# Altium schematic sheet SoC.SchDoc
size A4; SheetNumber: 4; SheetTotal: 4
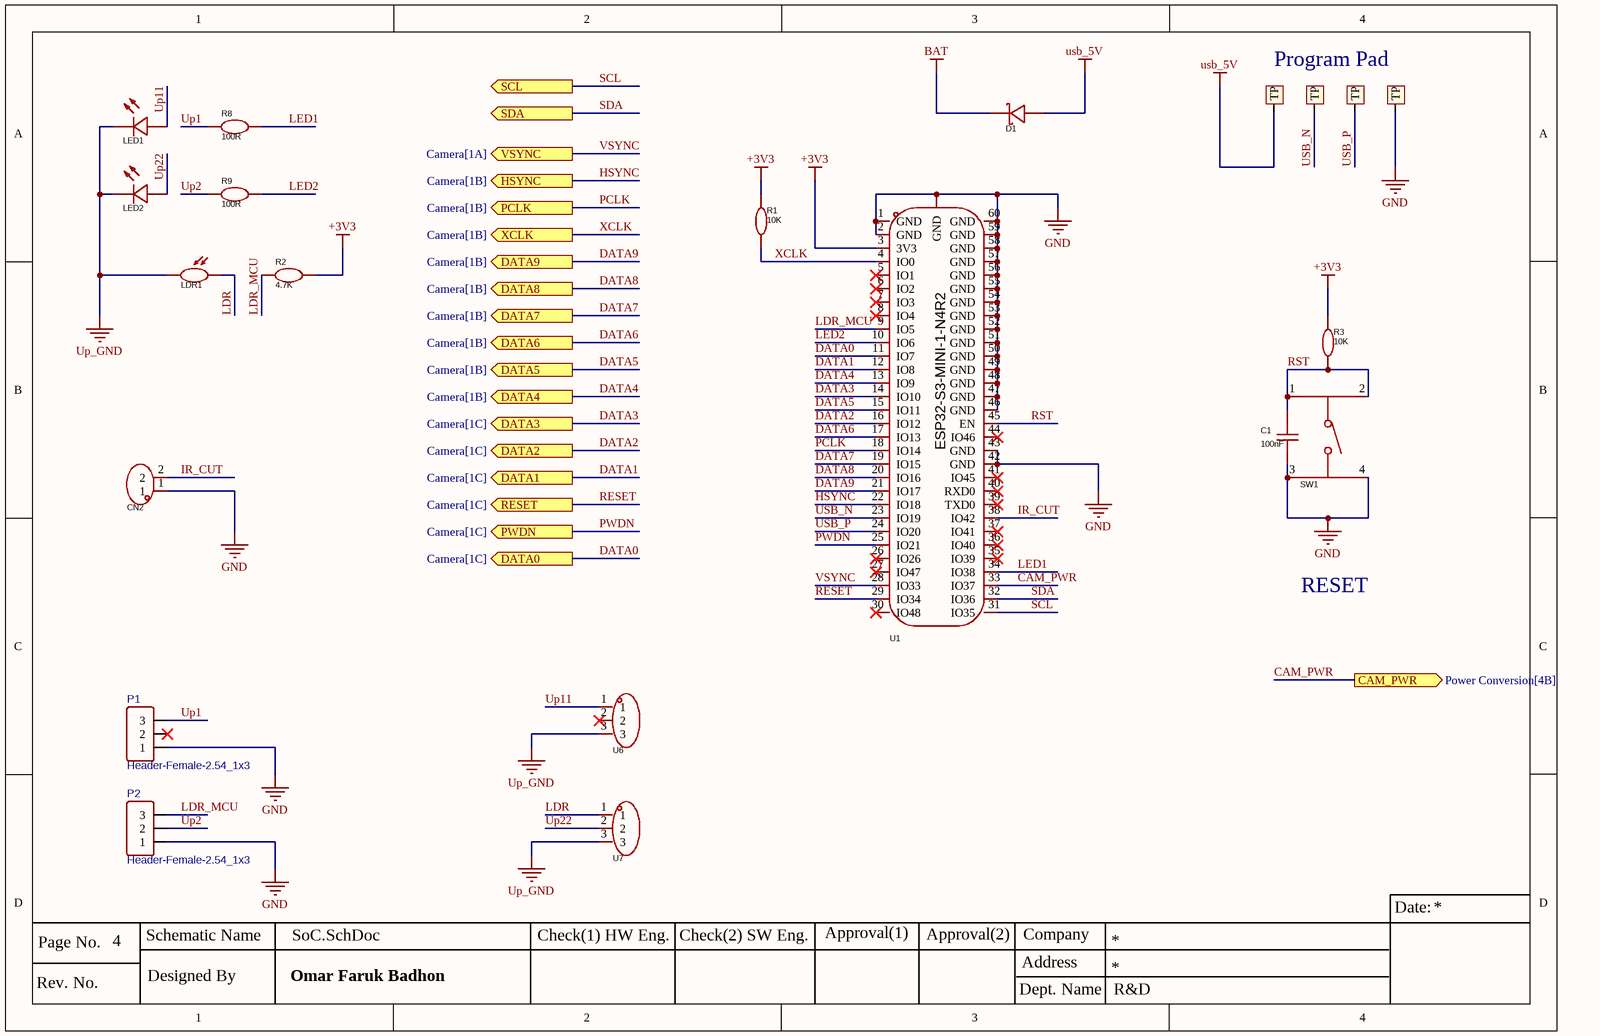
[diagram p0: SoC.SchDoc]

## Parts
C1  100nF  [100nF SMD Ceramic 201]
CN2  HDGC1501WV-2P  [2P white Connector 1.5mm]  (value not drawn)
D1  MBR120VLSFT1G  [Schottky Diode]  (value not drawn)
LDR1  GT36528  [LDR]  (value not drawn)
LED1  XYC-IRC18C-24  [LED SMD]  (value not drawn)
LED2  XYC-IRC18C-24  [LED SMD]  (value not drawn)
P1  Header-Female-2.54_1x3  [3P FH 2.54mm]
P2  Header-Female-2.54_1x3  [3P FH 2.54mm]
R1  10K  [10K SMD Ceramic 201]
R2  4.7K  [4k7 SMD 201]
R3  10K  [10K SMD Ceramic 201]
R8  100R  [100R 402]
R9  100R  [100R 402]
SW1  TS-1102-5516  [Push Button 4P]  (value not drawn)
TP1  TEST POINT  [TESTPOINT]  (value not drawn)
TP2  TEST POINT  [TESTPOINT]  (value not drawn)
TP3  TEST POINT  [TESTPOINT]  (value not drawn)
TP4  TEST POINT  [TESTPOINT]  (value not drawn)
U1  ESP32-S3-MINI-1-N4R2  [ESP32-S3-MINI-1-N8]
U6  HB-PH3-25413PB2GOP  [3P MH 2.54mm]  (value not drawn)
U7  HB-PH3-25413PB2GOP  [3P MH 2.54mm]  (value not drawn)

## Ports
CAM_PWR (out, see Power Conversion[4B]), DATA0 (out, see Camera[1C]), DATA1 (out, see Camera[1C]), DATA2 (out, see Camera[1C]), DATA3 (out, see Camera[1C]), DATA4 (out, see Camera[1B]), DATA5 (out, see Camera[1B]), DATA6 (out, see Camera[1B]), DATA7 (out, see Camera[1B]), DATA8 (out, see Camera[1B]), DATA9 (out, see Camera[1B]), HSYNC (out, see Camera[1B]), PCLK (out, see Camera[1B]), PWDN (out, see Camera[1C]), RESET (out, see Camera[1C]), SCL (out, see Camera[1A]), SDA (out, see Camera[1A]), VSYNC (out, see Camera[1A]), XCLK (out, see Camera[1B])

## Nets
+3V3: R1.2 R2.1 R3.2 U1.3(3V3)
BAT: D1.1(K)
GND: C1.1 CN2.1 P1.1 P2.1 SW1.3 SW1.4 TP4.1(TP) U1.1(GND) U1.2(GND) U1.42(GND) U1.43(GND) U1.46(GND) U1.47(GND) U1.48(GND) U1.49(GND) U1.50(GND) U1.51(GND) U1.52(GND) U1.53(GND) U1.54(GND) U1.55(GND) U1.56(GND) U1.57(GND) U1.58(GND) U1.59(GND) U1.60(GND) U1.GND
Up_GND: LDR1.1 LED1.1(C) LED2.1(C) U6.3 U7.3
usb_5V: D1.2(A) TP1.1(TP)
CAM_PWR: U1.33(IO37) ; port CAM_PWR
DATA0: U1.11(IO7) ; port DATA0
DATA1: U1.12(IO8) ; port DATA1
DATA2: U1.16(IO12) ; port DATA2
DATA3: U1.14(IO10) ; port DATA3
DATA4: U1.13(IO9) ; port DATA4
DATA5: U1.15(IO11) ; port DATA5
DATA6: U1.17(IO13) ; port DATA6
DATA7: U1.19(IO15) ; port DATA7
DATA8: U1.20(IO16) ; port DATA8
DATA9: U1.21(IO17) ; port DATA9
HSYNC: U1.22(IO18) ; port HSYNC
IR_CUT: CN2.2 U1.38(IO42)
LDR: LDR1.2 U7.1
LDR_MCU: P2.3 R2.2 U1.9(IO5)
LED1: R8.2 U1.34(IO38)
LED2: R9.2 U1.10(IO6)
PCLK: U1.18(IO14) ; port PCLK
PWDN: U1.25(IO21) ; port PWDN
RESET: U1.29(IO34) ; port RESET
RST: C1.2 R3.1 SW1.1 SW1.2 U1.45(EN)
SCL: U1.31(IO35) ; port SCL
SDA: U1.32(IO36) ; port SDA
Up1: P1.3 R8.1
Up2: P2.2 R9.1
Up11: LED1.2(A) U6.1
Up22: LED2.2(A) U7.2
USB_N: TP2.1(TP) U1.23(IO19)
USB_P: TP3.1(TP) U1.24(IO20)
VSYNC: U1.28(IO33) ; port VSYNC
XCLK: R1.1 U1.4(IO0) ; port XCLK

Not connected (* = marked no-connect by the designer): P1 2*; U1 5(IO1)* 6(IO2)* 7(IO3)* 8(IO4)* 26(IO26)* 27(IO47)* 30(IO48)* 35(IO39)* 36(IO40)* 37(IO41)* 39(TXD0)* 40(RXD0)* 41(IO45)* 44(IO46)*; U6 2*

## Notes on the sheet
- Program Pad
- RESET
- Date:
- Rev. No.
- Page No.
- Schematic Name
- Designed By
- Omar Faruk Badhon
- Check(1) HW Eng.
- Check(2) SW Eng.
- Approval(1)
- Approval(2)
- Address
- Company
- Dept. Name
- R&D

## Library data of the parts
C1 = 100nF SMD Ceramic 201: 10V 100nF X5R ±10% 0201 Multilayer Ceramic Capacitors MLCC - SMD/SMT ROHS; Manufacturer: muRata(村田); Symbol: GRM033R61A104KE84D; Add into BOM: yes; Device: GRM033R61A104KE84D; LCSC Part Name: 100nF ±10% 10V; Supplier Part: C161466; Manufacturer Part: GRM033R61A104KE84D; Supplier Footprint: 0201; JLCPCB Part Class: Extended Part; Datasheet: https://atta.szlcsc.com/upload/public/pdf/source/20181011/C161466_67687620A192BB2B75972275444AF1E7.pdf; Supplier: LCSC; Convert to PCB: yes; Value: 100nF; Tolerance: ±10%
CN2 = 2P Connector 1.5mm: Manufacturer: HDGC(华德共创); Add into BOM: yes; Pins Structure: 1x2P; Pitch: 1.5mm; Reference Series: ZH; Number of PINs Per Row: 2; Current Rating (Max): 1A; Symbol: HDGC1501WV-2P; Device: HDGC1501WV-2P; LCSC Part Name: 1x2P 间距:1.5mm 直插 系列:ZH; Supplier Part: C5175212; Manufacturer Part: HDGC1501WV-2P; Supplier Footprint: 插件,P=1.5mm; JLCPCB Part Class: Extended Part; Datasheet: https://atta.szlcsc.com/upload/public/pdf/source/20220916/0E4647A3A85E9D7CFB69507DE86E8F95.pdf; Supplier: LCSC; Convert to PCB: yes; Mounting Style: Direct Insert; Number of Pins: 2P; Number of Rows: 1
D1 = Schottky Diode: 20V 300mV@1A 1A SOD-123FL Schottky Diodes ROHS; Manufacturer: onsemi(安森美); Add into BOM: yes; Reverse Leakage Current (Ir): 600uA@20V; Symbol: MBR120VLSFT1G; Device: MBR120VLSFT1G; LCSC Part Name: 电压:20V 电流:1A; Supplier Part: C223608; Manufacturer Part: MBR120VLSFT1G; Supplier Footprint: SOD-123FL; JLCPCB Part Class: Extended Part; Datasheet: https://atta.szlcsc.com/upload/public/pdf/source/20221020/29D26ECD33A75D76A8E47ED9553F3BCF.pdf; Supplier: LCSC; Convert to PCB: yes; Forward Voltage (Vf@If): 300mV@1A; Reverse Voltage (Vr): 20V; Average Rectified Current (Io): 1A
LDR1 = LDR: SMD,2.4x3.6mm Photoresistors ROHS; Manufacturer: JCHL(晶创和立); Add into BOM: yes; Symbol: GT36528; Device: GT36528; LCSC Part Name: GT36528; Supplier Part: C2904881; Manufacturer Part: GT36528; Supplier Footprint: SMD,2.4x3.6mm; JLCPCB Part Class: Extended Part; Datasheet: https://atta.szlcsc.com/upload/public/pdf/source/20211014/6AB64DE2EFA295B23F73ED070F69DE44.pdf; Supplier: LCSC; Convert to PCB: yes
LED1 LED2 = LED SMD: Manufacturer: NEWOPTO(鑫永诚光电); Add into BOM: yes; Vf - Forward Voltage: 1.4V~1.8V; Power Dissipation: 900mW; Wavelength: 940nm; Current - DC Forward (If): 500mA; Reverse Voltage: 5V; View Angle: 120°; Symbol: XYC-IRC18C-24; Device: XYC-IRC18C-24; LCSC Part Name: XYC-IRC18C-24; Supplier Part: C2988733; Manufacturer Part: XYC-IRC18C-24; Supplier Footprint: SMD3030; JLCPCB Part Class: Extended Part; Datasheet: https://atta.szlcsc.com/upload/public/pdf/source/20220415/AF6ACF3234B7CCBAD1FA94129DBDDB73.pdf; Supplier: LCSC; Convert to PCB: yes; Operating Temperature: -40℃~+85℃
P1 P2 = Header-Female-2.54_1x3: Manufacturer: BOOMELE(博穆精密); Manufacturer Part: 2.54-1*3P母; Supplier Part: C146243; Supplier: LCSC; JLCPCB Part Class: Extended Part; spicePre: P; spiceSymbolName: Header-Female-2.54_1x3
R1 R3 = 10K SMD Ceramic 201: 50mW Thick Film Resistors 25V ±1% ±200ppm/℃ 10kΩ 0201 Chip Resistor - Surface Mount ROHS; Manufacturer: YAGEO(国巨); Symbol: AF0201FR-0710KL; Add into BOM: yes; Device: AF0201FR-0710KL; LCSC Part Name: 厚膜电阻 10kΩ ±1% 50mW; Supplier Part: C143978; Manufacturer Part: AF0201FR-0710KL; Supplier Footprint: 0201; JLCPCB Part Class: Extended Part; Datasheet: https://atta.szlcsc.com/upload/public/pdf/source/20180927/C229861_4ABDC471507C1ED6AFB4BA66AFC8620A.pdf; Supplier: LCSC; Convert to PCB: yes; Type: Thick Film Resistors; Value: 10kΩ; Tolerance: ±1%; Temperature Coefficient: ±200ppm/℃; Operating Temperature Range: -55℃~+125℃
R2 = 4K7 SMD 201: 50mW Thick Film Resistors 25V ±1% ±200ppm/℃ 4.7kΩ 0201 Chip Resistor - Surface Mount ROHS; Manufacturer: YAGEO(国巨); Symbol: AF0201FR-074K7L; Add into BOM: yes; Device: AF0201FR-074K7L; LCSC Part Name: 厚膜电阻 4.7kΩ ±1% 50mW; Supplier Part: C2105831; Manufacturer Part: AF0201FR-074K7L; Supplier Footprint: 0201; JLCPCB Part Class: Extended Part; Datasheet: https://atta.szlcsc.com/upload/public/pdf/source/20210712/C2105831_B7E5D2600BF229B29F1C9CE0CCE2B3D7.pdf; Supplier: LCSC; Convert to PCB: yes; Type: Thick Film Resistors; Value: 4.7kΩ; Tolerance: ±1%; Temperature Coefficient: ±200ppm/℃; Operating Temperature Range: -55℃~+125℃
R8 R9 = 100R 402: 100mW Thick Film Resistors ±100ppm/℃ ±1% 100Ω 0402 Chip Resistor - Surface Mount ROHS; Manufacturer: PANASONIC(松下); Symbol: ERJ2RKF1000X; Add into BOM: yes; Device: ERJ2RKF1000X; LCSC Part Name: 100Ω ±1% 100mW 厚膜电阻; Supplier Part: C413063; Manufacturer Part: ERJ2RKF1000X; Supplier Footprint: 0402; JLCPCB Part Class: Extended Part; Datasheet: https://atta.szlcsc.com/upload/public/pdf/source/20190820/C413063_95D61CC78C57CA6EC5636452389D6E3B.pdf; Supplier: LCSC; Convert to PCB: yes; Type: Thick Film Resistors; Value: 100Ω; Tolerance: ±1%; Overload Voltage (Max): -; Temperature Coefficient: ±100ppm/℃; Operating Temperature Range: -55℃~+155℃
SW1 = Push Button 4P: 6mm 5.5mm Round Button 25mA Direct Insert 6mm SPST 100000 Times 1.6N 24V Plugin Tactile Switches ROHS; Manufacturer: SOFNG(硕方); Add into BOM: yes; Actuator/Cap Color: Black; Mechanical Life: 100000次; Symbol: TS-1102-5516; Device: TS-1102-5516; LCSC Part Name: 6*6*5.5mm 直插 轻触开关; Supplier Part: C183624; Manufacturer Part: TS-1102-5516; Supplier Footprint: 插件; JLCPCB Part Class: Extended Part; Datasheet: https://atta.szlcsc.com/upload/public/pdf/source/20200911/C111374_C70AFD1A656F1EADE52E4A6E5D3FC819.pdf; Supplier: LCSC; Convert to PCB: yes; Circuit: SPST; Actuator Style: Round Button; Operating Force: 1.6N; Mounting Style: Straight; Switch Length: 6mm; Switch Width: 6mm; Switch Height: 5.5mm; Contact Current: 25mA; Voltage Rating (DC): 24V; With Lamp: -; Operating Temperature: -40℃~+85℃
U1 = ESP32-S3-MINI-1-N4R2: Manufacturer: ESPRESSIF(乐鑫); Add into BOM: yes; Antenna Type: 板载PCBAntenna; Symbol: ESP32-S3-MINI-1-N4R2; Device: ESP32-S3-MINI-1-N4R2; LCSC Part Name: ESP32-S3-MINI-1-N4R2; Supplier Part: C3013941; Manufacturer Part: ESP32-S3-MINI-1-N4R2; Supplier Footprint: SMD; JLCPCB Part Class: Extended Part; Supplier: LCSC; Convert to PCB: yes
U6 U7 = 3P MH 2.54mm: Manufacturer: HANBO(汉博); Add into BOM: yes; Pin Structure: 1x3P; Pitch: 2.54mm; Circluar Pins/Square Pins: Square Pins; Current Rating (Max): 3A; Voltage Rating (Max): 250V; Soldering Temperature(Max): 260℃; Symbol: HB-PH3-25413PB2GOP; Device: HB-PH3-25413PB2GOP; LCSC Part Name: 间距:2.54mm 1x3P 直插 方针; Supplier Part: C6332196; Manufacturer Part: HB-PH3-25413PB2GOP; Supplier Footprint: 插件,P=2.54mm; JLCPCB Part Class: Extended Part; Datasheet: https://atta.szlcsc.com/upload/public/pdf/source/20230803/F72D259687963761DF1B552F3BB84A31.pdf; Supplier: LCSC; Convert to PCB: yes; Row Spacing: 2.54mm; Mounting Type: Straight; Number of Rows: Plugin; Number of Pins: 3P; Length of Mating Pin: 6mm; Insulation Height: 2.54mm; Length of End Connection Pin: 3mm; Contact Plating: Gold; Operating Temperature Range: -40℃~+105℃; Color: Black